# Altium project Đoan2.PrjPcb
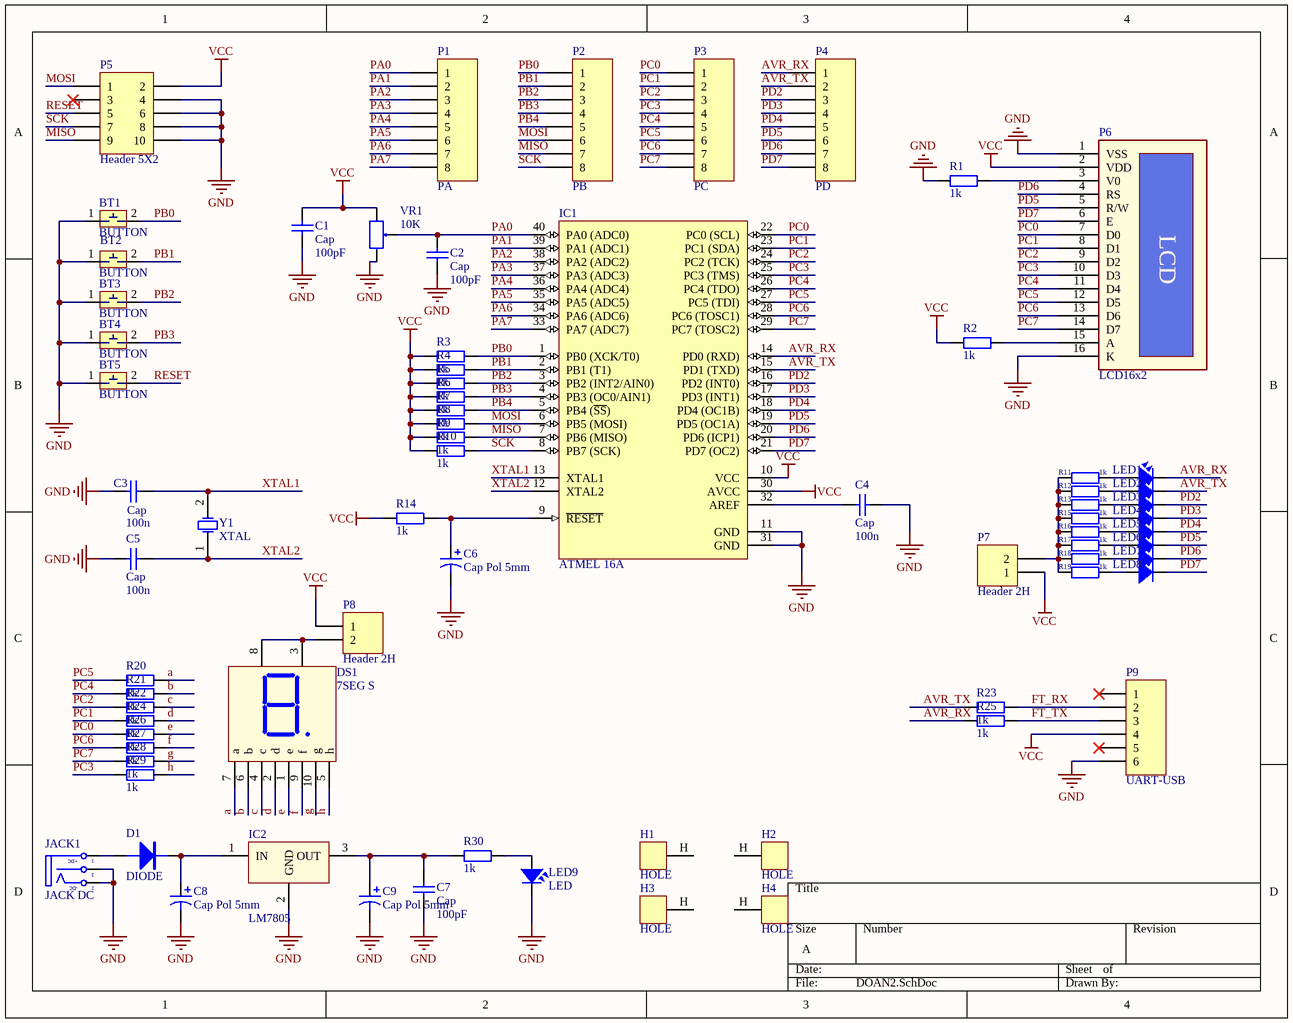
[diagram p0: DOAN2.SchDoc]
1 sheet, 73 parts. Net scope: global (net labels, ports and power ports of the same name join across sheets).
Board file: DOAN2.PcbDoc

## Sheet DOAN2.SchDoc
size A

### Parts
BT1  BUTTON  [BUTTON 4 PIN]
BT2  BUTTON  [BUTTON 4 PIN]
BT3  BUTTON  [BUTTON 4 PIN]
BT4  BUTTON  [BUTTON 4 PIN]
BT5  BUTTON  [BUTTON 4 PIN]
C1  Cap  value 100pF  [CAP 10x DIP]
C2  Cap  value 100pF  [CAP 10x DIP]
C3  Cap  value 100n  [CAP 10x DIP]
C4  Cap  value 100n  [CAP 10x DIP]
C5  Cap  value 100n  [CAP 10x DIP]
C6  Cap Pol 5mm  [C5mm]
C7  Cap  value 100pF  [CAP 10x DIP]
C8  Cap Pol 5mm  [CAP_D10]
C9  Cap Pol 5mm  [CAP_D18]
D1  DIODE  [DIODE DIP]
DS1  7SEG S  [7SEGS]
H1  HOLE  [HOLE]
H2  HOLE  [HOLE]
H3  HOLE  [HOLE]
H4  HOLE  [HOLE]
IC1  ATMEL 16A  [DIP40/W0.6]
IC2  LM7805  [QTO-220]
JACK1  JACK DC  [JACK DC]
LED1  (no value)  [LED-5 GRe]
LED2  (no value)  [LED-5 GRe]
LED3  (no value)  [LED-5 GRe]
LED4  (no value)  [LED-5 GRe]
LED5  (no value)  [LED-5 GRe]
LED6  (no value)  [LED-5 GRe]
LED7  (no value)  [LED-5 GRe]
LED8  (no value)  [LED-5 GRe]
LED9  LED  [LED-5 GRe]
P1  PA  [HDR1X8]
P2  PB  [HDR1X8]
P3  PC  [HDR1X8]
P4  PD  [HDR1X8]
P5  Header 5X2  [IDC10 MALE]
P6  LCD16x2  [HDR1X16]
P7  Header 2H  [HDR1X2]
P8  Header 2H  [HDR1X2]
P9  UART-USB  [HDR1X6]
R1  1k  [R1/2W]
R2  1k  [R1/2W]
R3  1k  [R1/2W]
R4  1k  [R1/2W]
R5  1k  [R1/2W]
R6  1k  [R1/2W]
R7  1k  [R1/2W]
R8  1k  [R1/2W]
R9  1k  [R1/2W]
R10  1k  [R1/2W]
R11  1k  [R1/2W]
R12  1k  [R1/2W]
R13  1k  [R1/2W]
R14  1k  [R1/2W]
R15  1k  [R1/2W]
R16  1k  [R1/2W]
R17  1k  [R1/2W]
R18  1k  [R1/2W]
R19  1k  [R1/2W]
R20  1k  [R1/2W]
R21  1k  [R1/2W]
R22  1k  [R1/2W]
R23  1k  [R1/2W]
R24  1k  [R1/2W]
R25  1k  [R1/2W]
R26  1k  [R1/2W]
R27  1k  [R1/2W]
R28  1k  [R1/2W]
R29  1k  [R1/2W]
R30  1k  [R1/2W]
VR1  10K  [RVAR]
Y1  XTAL  [CRYSTAL DIP]

### Nets
GND: BT1.1 BT2.1 BT3.1 BT4.1 BT5.1 C1.1 C2.1 C3.1 C4.2 C5.1 C6.2 C7.1 C8.2 C9.2 IC1.11(GND) IC1.31(GND) IC2.2(GND) JACK1.2(TN) JACK1.3(S) LED9.2 P5.4 P5.6 P5.8 P5.10 P6.1(VSS) P6.16(K) P9.6 R1.2 VR1.3
VCC: C1.2 IC1.10(VCC) IC1.30(AVCC) P5.2 P6.2(VDD) P7.1 P8.1 P9.4 R2.2 R3.1 R4.1 R5.1 R6.1 R7.1 R8.1 R9.1 R10.1 R14.2 VR1.1
a: DS1.7(a) R20.2
AVR_RX: IC1.14(PD0_(RXD)) LED1.2 P4.1 R25.1
AVR_TX: IC1.15(PD1_(TXD)) LED2.2 P4.2 R23.1
b: DS1.6(b) R21.2
c: DS1.4(c) R22.2
d: DS1.2(d) R24.2
e: DS1.1(e) R26.2
f: DS1.9(f) R27.2
FT_RX: P9.2 R23.2
FT_TX: P9.3 R25.2
g: DS1.10(g) R28.2
h: DS1.5(h) R29.2
MISO: IC1.7(PB6_(MISO)) P2.7 P5.9 R9.2
MOSI: IC1.6(PB5_(MOSI)) P2.6 P5.1 R8.2
PA0: C2.2 IC1.40(PA0_(ADC0)) P1.1 VR1.2
PA1: IC1.39(PA1_(ADC1)) P1.2
PA2: IC1.38(PA2_(ADC2)) P1.3
PA3: IC1.37(PA3_(ADC3)) P1.4
PA4: IC1.36(PA4_(ADC4)) P1.5
PA5: IC1.35(PA5_(ADC5)) P1.6
PA6: IC1.34(PA6_(ADC6)) P1.7
PA7: IC1.33(PA7_(ADC7)) P1.8
PB0: BT1.2 IC1.1(PB0_(XCK/T0)) P2.1 R3.2
PB1: BT2.2 IC1.2(PB1_(T1)) P2.2 R4.2
PB2: BT3.2 IC1.3(PB2_(INT2/AIN0)) P2.3 R5.2
PB3: BT4.2 IC1.4(PB3_(OC0/AIN1)) P2.4 R6.2
PB4: IC1.5(PB4_(~{SS})) P2.5 R7.2
PC0: IC1.22(PC0_(SCL)) P3.1 P6.7(D0) R26.1
PC1: IC1.23(PC1_(SDA)) P3.2 P6.8(D1) R24.1
PC2: IC1.24(PC2_(TCK)) P3.3 P6.9(D2) R22.1
PC3: IC1.25(PC3_(TMS)) P3.4 P6.10(D3) R29.1
PC4: IC1.26(PC4_(TDO)) P3.5 P6.11(D4) R21.1
PC5: IC1.27(PC5_(TDI)) P3.6 P6.12(D5) R20.1
PC6: IC1.28(PC6_(TOSC1)) P3.7 P6.13(D6) R27.1
PC7: IC1.29(PC7_(TOSC2)) P3.8 P6.14(D7) R28.1
PD2: IC1.16(PD2_(INT0)) LED3.2 P4.3
PD3: IC1.17(PD3_(INT1)) LED4.2 P4.4
PD4: IC1.18(PD4_(OC1B)) LED5.2 P4.5
PD5: IC1.19(PD5_(OC1A)) LED6.2 P4.6 P6.5(R/W)
PD6: IC1.20(PD6_(ICP1)) LED7.2 P4.7 P6.4(RS)
PD7: IC1.21(PD7_(OC2)) LED8.2 P4.8 P6.6(E)
RESET: BT5.2 P5.5
SCK: IC1.8(PB7_(SCK)) P2.8 P5.7 R10.2
XTAL1: C3.2 IC1.13(XTAL1) Y1.2(OSC2)
XTAL2: C5.2 IC1.12(XTAL2) Y1.1(OSC1)
NetC4_1: C4.1 IC1.32(AREF)
NetC6_1: C6.1 IC1.9(~{RESET}) R14.1
NetC7_2: C7.2 C9.1 IC2.3(OUT) R30.1
NetC8_1: C8.1 D1.2 IC2.1(IN)
NetD1_1: D1.1 JACK1.1(T)
NetDS1_3: DS1.3(Vcc) DS1.8(Vcc) P8.2
NetLED1_1: LED1.1 R11.2
NetLED2_1: LED2.1 R12.2
NetLED3_1: LED3.1 R13.2
NetLED4_1: LED4.1 R15.2
NetLED5_1: LED5.1 R16.2
NetLED6_1: LED6.1 R17.2
NetLED7_1: LED7.1 R18.2
NetLED8_1: LED8.1 R19.2
NetLED9_1: LED9.1 R30.2
NetP6_3: P6.3(V0) R1.1
NetP6_15: P6.15(A) R2.1
NetP7_2: P7.2 R11.1 R12.1 R13.1 R15.1 R16.1 R17.1 R18.1 R19.1

Not connected (* = marked no-connect by the designer): H1 H(HOLE); H2 H(HOLE); H3 H(HOLE); H4 H(HOLE); P5 3*; P9 1* 5*

### Notes on the sheet
- (in symbol JACK DC) +DC; -DC
- (in symbol LCD Text) LCD

### Library data of the parts
C1-C5 C7 = Cap: Capacitor; Published: 8-Jun-2000; LatestRevisionDate: 17-Jul-2002; LatestRevisionNote: Re-released for DXP Platform.; PackageReference: RAD-0.3; Publisher: Altium Limited; PackageDescription: Radial Cap, Thru-Hole; 2 Leads; 0.3 in Pin Spacing
C6 C8 C9 = Cap Pol 5mm: Polarized Capacitor (Axial); Published: 8-Jun-2000; LatestRevisionDate: 17-Jul-2002; LatestRevisionNote: Re-released for DXP Platform.; PackageReference: POLAR0.8; Publisher: Altium Limited
DS1 = LED7S: Single 7 Seg Dipslay; Value: LED 7S SEG
IC1 = ATmega16A-PU: 8-Bit AVR Microcontroller with 16K Bytes of In-System Programmable Flash Memory; Value: Atmega 16L
IC2 = LM78xx: On ap +, from + 5 to + 24VDC; Value: LM7805
JACK1 = JACK DC: Value: Jac DC
LED1-LED9 = LED: LED Single colour Green and Red; Value: LED 3 ly Single Colour
P1-P4 = Header 8: LatestRevisionDate: 17-Jul-2002; LatestRevisionNote: Re-released for DXP Platform.; Publisher: Altium Limited
P6 = LCD Text
P9 = Header 6: LatestRevisionDate: 17-Jul-2002; LatestRevisionNote: Re-released for DXP Platform.; Publisher: Altium Limited
R1-R30 = RESISTOR: Value: R1/4W - 1K
VR1 = VAR RES: Value: VR 10K
Y1 = XTAL: Crystal Oscillator; Published: 8-Jun-2000; LatestRevisionDate: 17-Jul-2002; LatestRevisionNote: Re-released for DXP Platform.; PackageReference: R38; Publisher: Altium Limited; PackageDescription: Crystal, Thru-Hole; 2 Leads; Body 3.1 x 8.2 mm (Dia.xH)
P5 = Header 5X2: LatestRevisionDate: 17-Jul-2002; LatestRevisionNote: Re-released for DXP Platform.; Publisher: Altium Limited
P7 P8 = Header 2H: LatestRevisionDate: 17-Jul-2002; LatestRevisionNote: Re-released for DXP Platform.; Publisher: Altium Limited